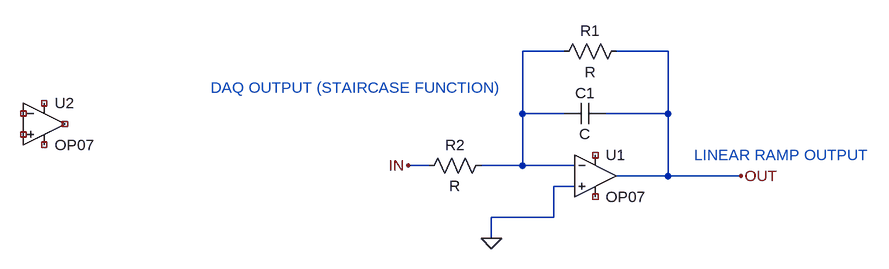
[diagram p0: schematic Draft1.asc]
Draft1.asc, the LTspice schematic file:
Version 4
SHEET 1 880 680
WIRE 144 -32 80 -32
WIRE 304 -32 224 -32
WIRE 80 64 80 -32
WIRE 144 64 80 64
WIRE 304 64 304 -32
WIRE 304 64 208 64
WIRE -64 144 -96 144
WIRE 80 144 80 64
WIRE 80 144 16 144
WIRE 160 144 80 144
WIRE 304 160 304 64
WIRE 304 160 224 160
WIRE 416 160 304 160
WIRE 160 176 128 176
WIRE 128 224 128 176
WIRE 128 224 32 224
WIRE 32 256 32 224
FLAG 32 256 0
FLAG -96 144 IN
FLAG 416 160 OUT
SYMBOL OpAmps\\OP07 192 96 R0
SYMATTR InstName U1
SYMBOL cap 208 48 R90
WINDOW 0 0 32 VBottom 2
WINDOW 3 32 32 VTop 2
SYMATTR InstName C1
SYMBOL res 240 -48 R90
WINDOW 0 0 56 VBottom 2
WINDOW 3 32 56 VTop 2
SYMATTR InstName R1
SYMBOL res 32 128 R90
WINDOW 0 0 56 VBottom 2
WINDOW 3 32 56 VTop 2
SYMATTR InstName R2
SYMBOL OpAmps\\OP07 -656 16 R0
SYMATTR InstName U2
TEXT -400 24 Left 2 ;DAQ OUTPUT (STAIRCASE FUNCTION)
TEXT 344 128 Left 2 ;LINEAR RAMP OUTPUT

The netlist it stands for:
* Draft1.asc
XU1 0 N001 NC_01 NC_02 OUT LT1001  ; OP07, pins In+ In- V+ V- OUT
C1 OUT N001 C
R1 OUT N001 R
R2 N001 IN R
XU2 NC_03 NC_04 NC_05 NC_06 NC_07 LT1001  ; OP07, pins In+ In- V+ V- OUT
* DAQ OUTPUT (STAIRCASE FUNCTION)
* LINEAR RAMP OUTPUT
.lib LTC.lib
.backanno
.end